# Altium schematic sheet 06 RFID.SchDoc
size A
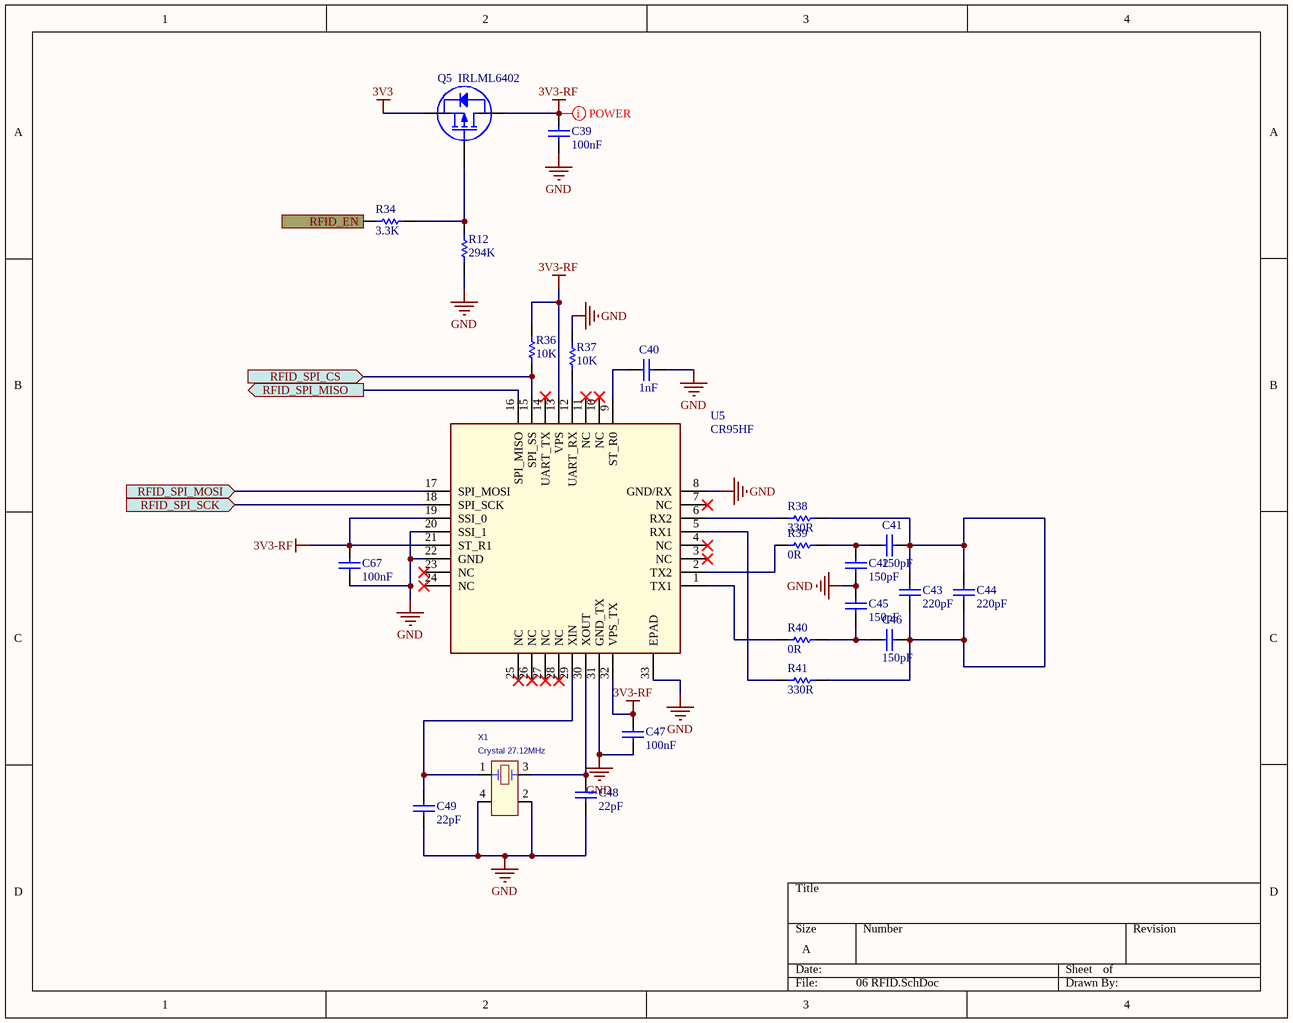
[diagram p0: 06 RFID.SchDoc]

## Parts
C39  100nF  [0603 - C]
C40  1nF  [0603 - C]
C41  150pF  [0603 - C]
C42  150pF  [0603 - C]
C43  220pF  [0603 - C]
C44  220pF  [0603 - C]
C45  150pF  [0603 - C]
C46  150pF  [0603 - C]
C47  100nF  [0603 - C]
C48  22pF  [0603 - C]
C49  22pF  [0603 - C]
C67  100nF  [0603 - C]
Q5  IRLML6402  [SOT23B]
R12  294K  [0603 - R]
R34  3.3K  [0603 - R]
R36  10K  [0603 - R]
R37  10K  [0603 - R]
R38  330R  [0603 - R]
R39  0R  [0603 - R]
R40  0R  [0603 - R]
R41  330R  [0603 - R]
U5  CR95HF  [32-VFQFN]
X1  Crystal 27.12MHz  [Crystal 2016]

## Ports
RFID_EN (in), RFID_SPI_CS (in), RFID_SPI_MISO (out), RFID_SPI_MOSI (in), RFID_SPI_SCK (in)

## Nets
3V3: Q5.2(S)
3V3-RF: C39.2 C47.2 C67.2 Q5.3(D) R36.2 U5.13(VPS) U5.19(SSI_0) U5.21(ST_R1) U5.32(VPS_TX)
GND: C39.1 C40.2 C42.1 C45.2 C47.1 C48.1 C49.1 C67.1 R12.1 R37.2 U5.8(GND/RX) U5.20(SSI_1) U5.22(GND) U5.31(GND_TX) U5.33(EPAD) X1.2(GND) X1.4(GND)
RFID_EN: R34.1 ; port RFID_EN
RFID_SPI_CS: R36.1 U5.15(SPI_SS) ; port RFID_SPI_CS
RFID_SPI_MISO: U5.16(SPI_MISO) ; port RFID_SPI_MISO
RFID_SPI_MOSI: U5.17(SPI_MOSI) ; port RFID_SPI_MOSI
RFID_SPI_SCK: U5.18(SPI_SCK) ; port RFID_SPI_SCK
NetC40_1: C40.1 U5.9(ST_R0)
NetC41_1: C41.1 C42.2 R39.2
NetC41_2: C41.2 C43.1 C43.2 C44.1 C44.2 C46.2 R38.2 R41.2
NetC45_1: C45.1 C46.1 R40.2
NetC48_2: C48.2 U5.30(XOUT) X1.3(OSC2)
NetC49_2: C49.2 U5.29(XIN) X1.1(OSC1)
NetQ5_1: Q5.1(G) R12.2 R34.2
NetR37_1: R37.1 U5.12(UART_RX)
NetR38_1: R38.1 U5.6(RX2)
NetR39_1: R39.1 U5.2(TX2)
NetR40_1: R40.1 U5.1(TX1)
NetR41_1: R41.1 U5.5(RX1)

Not connected (* = marked no-connect by the designer): U5 3(NC)* 4(NC)* 7(NC)* 10(NC)* 11(NC)* 14(UART_TX)* 23(NC)* 24(NC)* 25(NC)* 26(NC)* 27(NC)* 28(NC)*

## Layout directives
net class POWER: 3V3-RF

## Library data of the parts
C39 C47 C67 = Cap 0603 100nF: CAP CER 100nF 50V C0G/NP0 0603 ±5%; MPN: CL10C104JB8NNNC; MFR: SAMSUNG; Company ID: VT_CAP_C0603 100nF; Voltage: 50V; Package: 0603; Value: 100nF; Size: C0603: 100nF
C40 = Cap 0603 1nF: CAP CER 1000PF 50V C0G/NP0 0603; MPN: CL10C102JB8NNNC; MFR: SAMSUNG; Company ID: VT_CAP_C0603 1nF; Size: C0603: 1nF; Value: 1nF
C41 C42 C45 C46 = Cap 0603 150pF: CAP CER 150PF 50V C0G/NP0 0603; MPN: CL10C151JB8NNNC; MFR: SAMSUNG; Company ID: VT_CAP_C0603 150pF; Value: 150pF; Size: C0603: 150pF
C43 C44 = Cap 0603 220pF: CAP CER 220PF 50V C0G/NP0 0603; MPN: CL10C221JB8NNNC; MFR: SAMSUNG; Company ID: VT_CAP_C0603 220pF; Value: 220pF; Size: C0603: 220pF
C48 C49 = Cap 0603 22pF: CAP CER 22PF 50V C0G/NP0 0603; MPN: CL10C220JB8NNNC; MFR: SAMSUNG; Company ID: VT_CAP_C0603 22pF; Value: 22pF; Size: C0603: 22pF
Q5 = MOSFET IRLML6402TRPBF: MOSFET P-CH 30V 3.6A SOT-23-3; MFR: Infineon Technologies; Company ID: VT_MOSFET_IRLML6402TRPBF; MPN: IRLML6402TRPBF
R12 = Res 0603 294K: RES SMD 294K OHM 1% 1/10W 0603; MFR: Yageo; MPN: RC0603FR-07294KL; Company ID: VT_ĐIỆN TRỞ_R0603 294K; Value: 294K
R34 = Res 0603 3.3K: RES SMD 3.3K OHM 1% 1/10W 0603; MFR: Yageo; MPN: RC0603FR-073K3L; Company ID: VT_RES_R0603 3.3K; Value: 3.3K; Size: R0603: 3.3K
R36 R37 = Res 0603 10K: RES SMD 10K OHM 1% 1/10W 0603; MFR: Yageo; MPN: RC0603FR-0710KL; Company ID: VT_RES_R0603 10K; Size: R0603: 10K; Value: 10K
R38 R41 = Res 0603 330R: RES SMD 330OHM 1% 1/10W 0603; MFR: Yageo; MPN: RC0603FR-07330RL; Company ID: VT_RES_R0603 330R; Value: 330R; Size: R0603: 330R
R39 R40 = Res 0603 0R: RES SMD 0 OHM JUMPER 1/10W 0603; MFR: Yageo; MPN: RC0603FR-070RL; Company ID: VT_RES_R0603 0R; Size: R0603: 0R; Value: 0R
U5 = CR95HF: IC RFID RDR/TRN 13.56MZ 32VFQFPN; MPN: CR95HF-VMD5T; MFR: ST; Company ID: VT_IC_CR95HF
X1 = XTAL-XRCBG27M: CRYSTAL 27.12MHz RoHS; MPN: XRCGB27M120F3M00R0; MFR: Murata; Company ID: VT_CRYSTAL_SMD 27.12MHz